# EAGLE schematic 005743-001 (EAGLE 6.6.0)

## Sheet 1 of 2
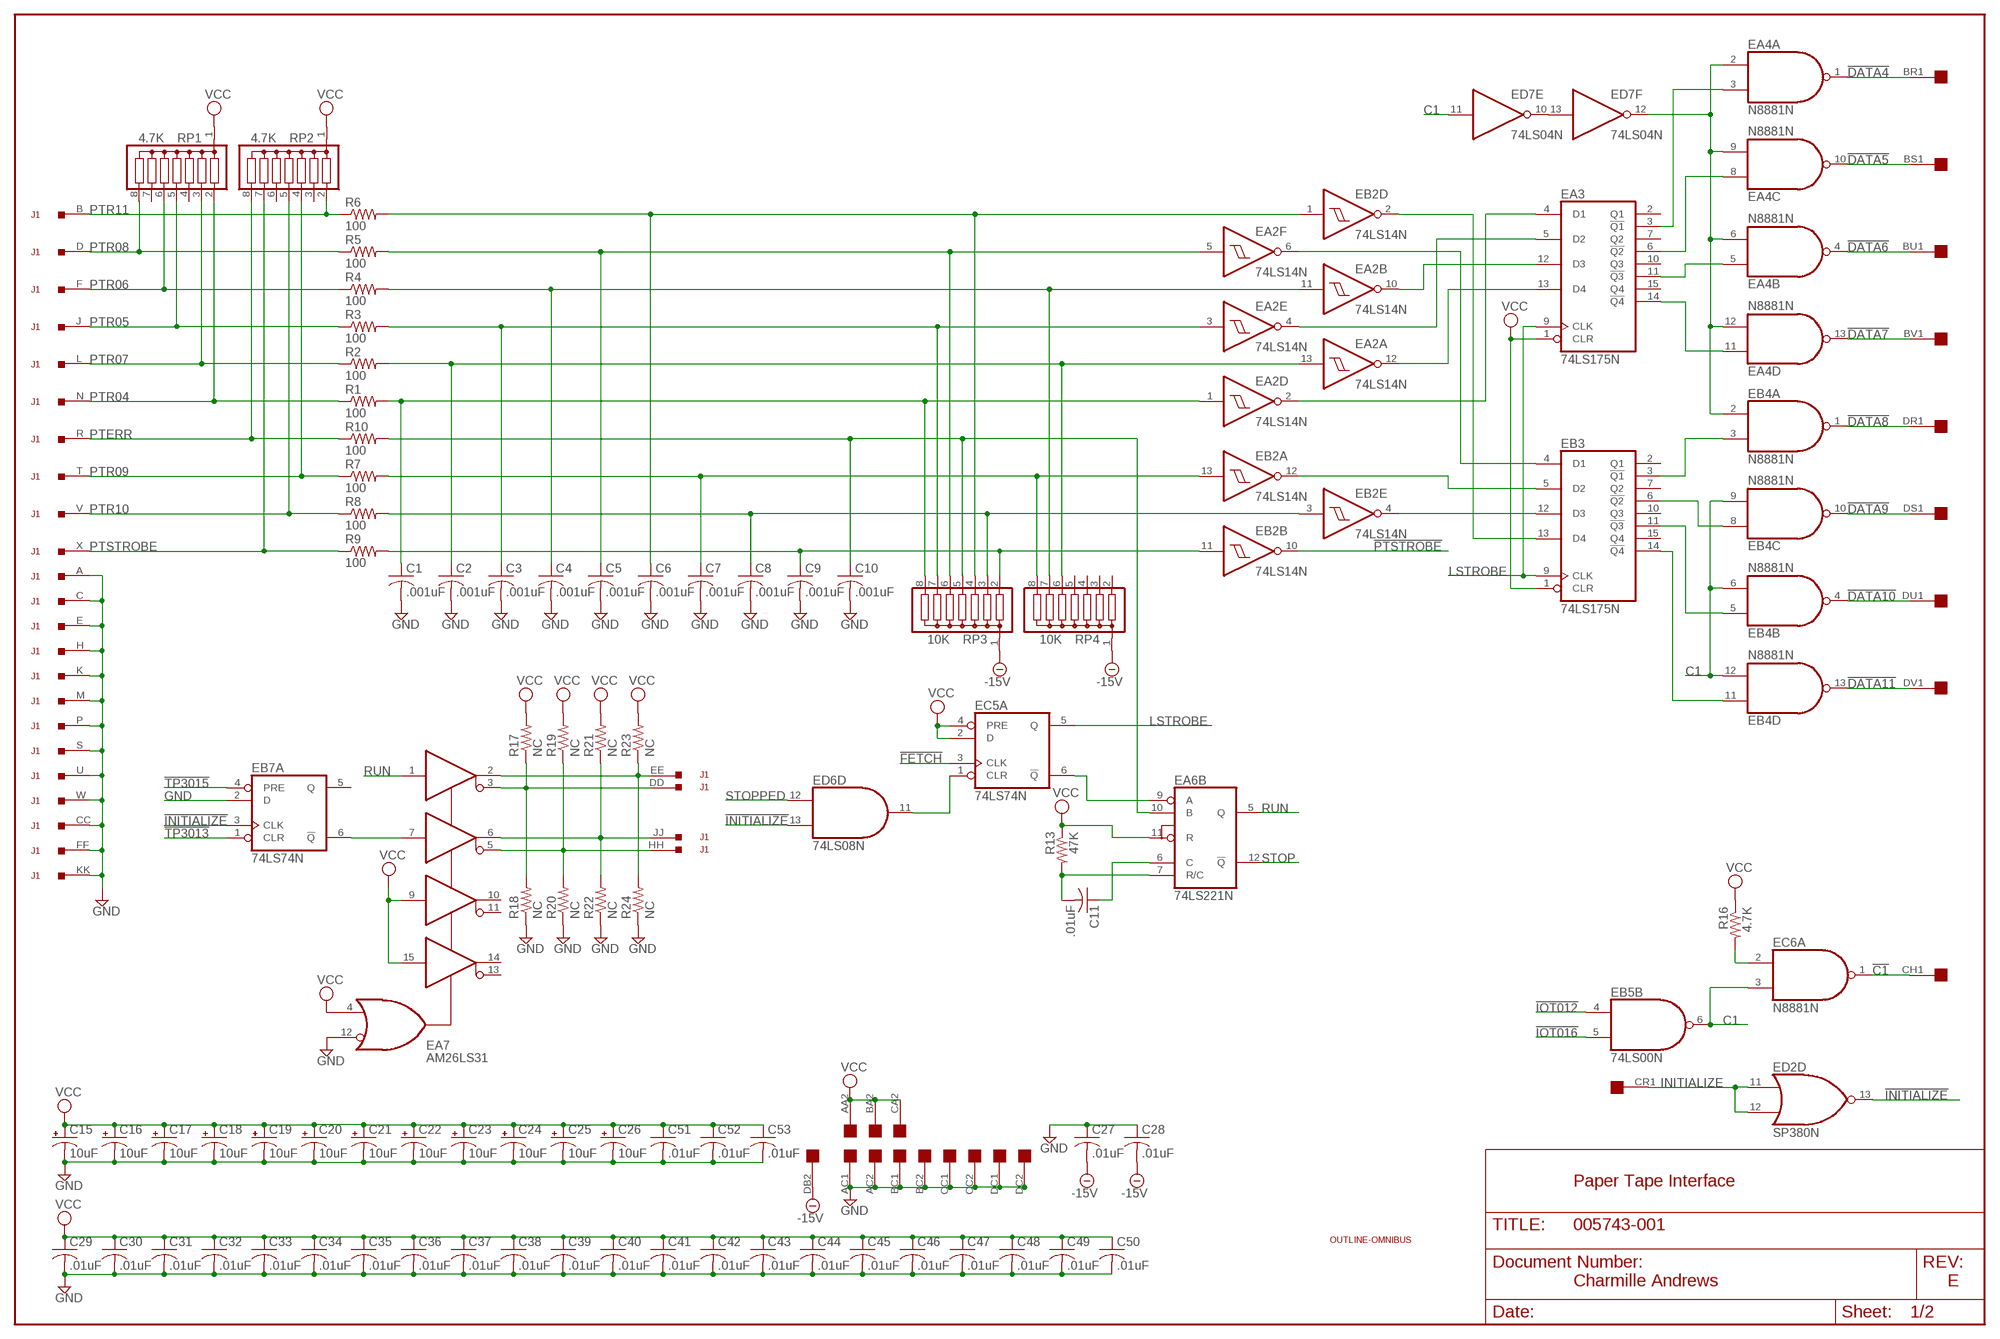
[diagram p0: schematic, sheet 1]

### Parts
C1  .001uF  C-US050-025X075  [C050-025X075]
C2  .001uF  C-US050-025X075  [C050-025X075]
C3  .001uF  C-US050-025X075  [C050-025X075]
C4  .001uF  C-US050-025X075  [C050-025X075]
C5  .001uF  C-US050-025X075  [C050-025X075]
C6  .001uF  C-US050-025X075  [C050-025X075]
C7  .001uF  C-US050-025X075  [C050-025X075]
C8  .001uF  C-US050-025X075  [C050-025X075]
C9  .001uF  C-US050-025X075  [C050-025X075]
C10  .001uF  C-US050-025X075  [C050-025X075]
C11  .01uF  C-US050-025X075  [C050-025X075]
C15  10uF  CPOL-USE15-5AXIAL  [E15-5]
C16  10uF  CPOL-USE15-5AXIAL  [E15-5]
C17  10uF  CPOL-USE15-5AXIAL  [E15-5]
C18  10uF  CPOL-USE15-5AXIAL  [E15-5]
C19  10uF  CPOL-USE15-5AXIAL  [E15-5]
C20  10uF  CPOL-USE15-5AXIAL  [E15-5]
C21  10uF  CPOL-USE15-5AXIAL  [E15-5]
C22  10uF  CPOL-USE15-5AXIAL  [E15-5]
C23  10uF  CPOL-USE15-5AXIAL  [E15-5]
C24  10uF  CPOL-USE15-5AXIAL  [E15-5]
C25  10uF  CPOL-USE15-5AXIAL  [E15-5]
C26  10uF  CPOL-USE15-5AXIAL  [E15-5]
C27  .01uF  C-US050-025X075  [C050-025X075]
C28  .01uF  C-US050-025X075  [C050-025X075]
C29  .01uF  C-US050-025X075  [C050-025X075]
C30  .01uF  C-US050-025X075  [C050-025X075]
C31  .01uF  C-US050-025X075  [C050-025X075]
C32  .01uF  C-US050-025X075  [C050-025X075]
C33  .01uF  C-US050-025X075  [C050-025X075]
C34  .01uF  C-US050-025X075  [C050-025X075]
C35  .01uF  C-US050-025X075  [C050-025X075]
C36  .01uF  C-US050-025X075  [C050-025X075]
C37  .01uF  C-US050-025X075  [C050-025X075]
C38  .01uF  C-US050-025X075  [C050-025X075]
C39  .01uF  C-US050-025X075  [C050-025X075]
C40  .01uF  C-US050-025X075  [C050-025X075]
C41  .01uF  C-US050-025X075  [C050-025X075]
C42  .01uF  C-US050-025X075  [C050-025X075]
C43  .01uF  C-US050-025X075  [C050-025X075]
C44  .01uF  C-US050-025X075  [C050-025X075]
C45  .01uF  C-US050-025X075  [C050-025X075]
C46  .01uF  C-US050-025X075  [C050-025X075]
C47  .01uF  C-US050-025X075  [C050-025X075]
C48  .01uF  C-US050-025X075  [C050-025X075]
C49  .01uF  C-US050-025X075  [C050-025X075]
C50  .01uF  C-US050-025X075  [C050-025X075]
C51  .01uF  C-US050-025X075  [C050-025X075]
C52  .01uF  C-US050-025X075  [C050-025X075]
C53  .01uF  C-US050-025X075  [C050-025X075]
EA2  74LS14N  [DIL14]
EA3  74LS175N  [DIL16]
EA4  N8881N  [DIL14]
EA6  74LS221N  [DIL16]
EA7  AM26LS31  [DIL16]
EB2  74LS14N  [DIL14]
EB3  74LS175N  [DIL16]
EB4  N8881N  [DIL14]
EB5  74LS00N  [DIL14]
EB7  74LS74N  [DIL14]
EC5  74LS74N  [DIL14]
EC6  N8881N  [DIL14]
ED2  SP380N  [DIL14]
ED6  74LS08N  [DIL14]
ED7  74LS04N  [DIL14]
J1  DEC40PINSH  [DEC40PINH]
R1  100  R-US_0207/12  [0207/12]
R2  100  R-US_0207/12  [0207/12]
R3  100  R-US_0207/12  [0207/12]
R4  100  R-US_0207/12  [0207/12]
R5  100  R-US_0207/12  [0207/12]
R6  100  R-US_0207/12  [0207/12]
R7  100  R-US_0207/12  [0207/12]
R8  100  R-US_0207/12  [0207/12]
R9  100  R-US_0207/12  [0207/12]
R10  100  R-US_0207/12  [0207/12]
R13  47K  R-US_0207/12  [0207/12]
R16  4.7K  R-US_0207/12  [0207/12]
R17  NC  R-US_0207/12  [0207/12]
R18  NC  R-US_0207/12  [0207/12]
R19  NC  R-US_0207/12  [0207/12]
R20  NC  R-US_0207/12  [0207/12]
R21  NC  R-US_0207/12  [0207/12]
R22  NC  R-US_0207/12  [0207/12]
R23  NC  R-US_0207/12  [0207/12]
R24  NC  R-US_0207/12  [0207/12]
RP1  4.7K  G07R  [SIL8]
RP2  4.7K  G07R  [SIL8]
RP3  10K  G07R  [SIL8]
RP4  10K  G07R  [SIL8]
U$1  OUTLINE-OMNIBUS  [OMNIBUS]
U$2  QUAD  [EDGE-CON8]

### Nets
!C1: EC6.1(A:O) U$2.CH1
!DATA4: EA4.1(A:O) U$2.BR1
!DATA5: EA4.10(C:O) U$2.BS1
!DATA6: EA4.4(B:O) U$2.BU1
!DATA7: EA4.13(D:O) U$2.BV1
!DATA8: EB4.1(A:O) U$2.DR1
!DATA9: EB4.10(C:O) U$2.DS1
!DATA10: EB4.4(B:O) U$2.DU1
!DATA11: EB4.13(D:O) U$2.DV1
!FETCH: EC5.3(A:CLK) ; also sheet 2
!INITIALIZE: EB7.3(A:CLK) ED2.13(D:O) ED6.13(D:I1) ; also sheet 2
!IOT012: EB5.4(B:I0) ; also sheet 2
!IOT016: EB5.5(B:I1) ; also sheet 2
!PTSTROBE: EB2.10(B:O) ; also sheet 2
!TP3013: EB7.1(A:CLR) ; also sheet 2
!TP3015: EB7.4(A:PRE) ; also sheet 2
-15V [supply]: C27.2 C28.2 RP3.1 RP4.1 U$2.DB2
C1: EB4.6(B:I1) EB4.9(C:I1) EB4.12(D:I1) EB5.6(B:O) EC6.3(A:I1) ED7.11(E:I)
GND [supply]: C1.2 C2.2 C3.2 C4.2 C5.2 C6.2 C7.2 C8.2 C9.2 C10.2 C15.- C16.- C17.- C18.- C19.- C20.- C21.- C22.- C23.- C24.- C25.- C26.- C27.1 C28.1 C29.2 C30.2 C31.2 C32.2 C33.2 C34.2 C35.2 C36.2 C37.2 C38.2 C39.2 C40.2 C41.2 C42.2 C43.2 C44.2 C45.2 C46.2 C47.2 C48.2 C49.2 C50.2 C51.2 C52.2 C53.2 EA7.12(!G) EB7.2(A:D) J1.A J1.C J1.CC J1.E J1.FF J1.H J1.K J1.KK J1.M J1.P J1.S J1.U J1.W R18.1 R20.1 R22.1 R24.1 U$2.AC1 U$2.AC2 U$2.BC1 U$2.BC2 U$2.CC1 U$2.CC2 U$2.DC1 U$2.DC2 ; also sheet 2
INITIALIZE: ED2.11(D:I0) ED2.12(D:I1) U$2.CR1
LSTROBE: EA3.9(CLK) EB3.9(CLK) EC5.5(A:Q) ; also sheet 2
N$18: EA4.2(A:I0) EA4.6(B:I1) EA4.9(C:I1) EA4.12(D:I1) EB4.2(A:I0) ED7.12(F:O)
N$19: EA2.6(F:O) EB3.4(D1)
N$20: ED7.10(E:O) ED7.13(F:I)
N$26: EA7.2(Y1) J1.EE R23.1 R24.2
N$33: EA7.3(Z1) J1.DD R17.1 R18.2
N$40: EC5.1(A:CLR) ED6.11(D:O)
N$41: EA7.5(Z2) J1.HH R19.1 R20.2
N$43: EA7.6(Y2) J1.JJ R21.1 R22.2
N$44: EB2.2(D:O) EB3.13(D4)
N$45: EA2.12(A:O) EA3.13(D4)
N$49: EA7.7(A2) EB7.6(A:!Q)
N$51: EA2.10(B:O) EA3.12(D3)
N$54: EA3.6(!Q2) EA4.8(C:I0)
N$65: EA6.9(B:A) EC5.6(A:!Q)
N$66: EC6.2(A:I0) R16.2
N$70: C10.1 EA6.10(B:B) R10.2 RP3.5
N$71: C11.1 EA6.6(B:C)
N$72: EA2.2(D:O) EA3.4(D1)
N$73: EA3.3(!Q1) EA4.3(A:I1)
N$76: EA3.14(!Q4) EA4.11(D:I0)
N$77: C11.2 EA6.7(B:R/C) R13.2
N$222: EB3.14(!Q4) EB4.11(D:I0)
N$224: EB3.6(!Q2) EB4.8(C:I0)
N$226: EB3.11(!Q3) EB4.5(B:I0)
N$227: EB3.3(!Q1) EB4.3(A:I1)
N$232: EB2.12(A:O) EB3.5(D2)
N$239: EB2.4(E:O) EB3.12(D3)
N$247: C7.1 EB2.13(A:I) R7.2 RP4.8
N$250: C8.1 EB2.3(E:I) R8.2 RP3.3
N$251: C6.1 EB2.1(D:I) R6.2 RP3.4
N$253: C9.1 EB2.11(B:I) R9.2 RP3.2
N$294: EA3.11(!Q3) EA4.5(B:I0)
N$300: EA2.4(E:O) EA3.5(D2)
N$313: C2.1 EA2.13(A:I) R2.2 RP4.6
N$315: C5.1 EA2.5(F:I) R5.2 RP3.6
N$316: C3.1 EA2.3(E:I) R3.2 RP3.7
N$317: C1.1 EA2.1(D:I) R1.2 RP3.8
N$319: C4.1 EA2.11(B:I) R4.2 RP4.7
PTERR: J1.R R10.1 RP2.8
PTR04: J1.N R1.1 RP1.2
PTR05: J1.J R3.1 RP1.5
PTR06: J1.F R4.1 RP1.6
PTR07: J1.L R2.1 RP1.3
PTR08: J1.D R5.1 RP1.8
PTR09: J1.T R7.1 RP2.4
PTR10: J1.V R8.1 RP2.5
PTR11: J1.B R6.1 RP2.2
PTSTROBE: J1.X R9.1 RP2.7
RUN: EA6.5(B:Q) EA7.1(A1) ; also sheet 2
STOP: EA6.12(B:!Q) ; also sheet 2
STOPPED: ED6.12(D:I0) ; also sheet 2
VCC [supply]: C15.+ C16.+ C17.+ C18.+ C19.+ C20.+ C21.+ C22.+ C23.+ C24.+ C25.+ C26.+ C29.1 C30.1 C31.1 C32.1 C33.1 C34.1 C35.1 C36.1 C37.1 C38.1 C39.1 C40.1 C41.1 C42.1 C43.1 C44.1 C45.1 C46.1 C47.1 C48.1 C49.1 C50.1 C51.1 C52.1 C53.1 EA3.1(CLR) EA6.11(B:R) EA7.4(G) EA7.9(A3) EA7.15(A4) EB3.1(CLR) EC5.2(A:D) EC5.4(A:PRE) R13.1 R16.1 R17.2 R19.2 R21.2 R23.2 RP1.1 RP2.1 U$2.AA2 U$2.BA2 U$2.CA2 ; also sheet 2
Unconnected: EA3.2(Q1) EA3.7(Q2) EA3.10(Q3) EA3.15(Q4) EA7.10(Y3) EA7.11(Z3) EA7.13(Z4) EA7.14(Y4) EB3.2(Q1) EB3.7(Q2) EB3.10(Q3) EB3.15(Q4) EB7.5(A:Q) ED7.8(D:O) ED7.9(D:I) J1.AA J1.BB J1.LL J1.MM J1.NN J1.PP J1.RR J1.SS J1.TT J1.UU J1.VV J1.Y J1.Z RP1.4 RP1.7 RP2.3 RP2.6 RP4.2 RP4.3 RP4.4 RP4.5 U$2.AA1 U$2.AB1 U$2.AB2 U$2.AD1 U$2.AD2 U$2.AE1 U$2.AE2 U$2.AF1 U$2.AF2 U$2.AH1 U$2.AH2 U$2.AJ1 U$2.AJ2 U$2.AK1 U$2.AK2 U$2.AL1 U$2.AL2 U$2.AM1 U$2.AM2 U$2.AN1 U$2.AN2 U$2.AP2 U$2.AR1 U$2.AR2 U$2.AS1 U$2.AS2 U$2.AT1 U$2.AT2 U$2.AU1 U$2.AU2 U$2.AV1 U$2.AV2 U$2.BA1 U$2.BB1 U$2.BB2 U$2.BD1 U$2.BD2 U$2.BE1 U$2.BE2 U$2.BF1 U$2.BF2 U$2.BH1 U$2.BH2 U$2.BJ1 U$2.BJ2 U$2.BK2 U$2.BL2 U$2.BM2 U$2.BN1 U$2.BN2 U$2.BP2 U$2.BR2 U$2.BS2 U$2.BT1 U$2.BT2 U$2.BU2 U$2.BV2 U$2.CA1 U$2.CB1 U$2.CB2 U$2.CD2 U$2.CE1 U$2.CE2 U$2.CF1 U$2.CF2 U$2.CJ1 U$2.CJ2 U$2.CK1 U$2.CK2 U$2.CL2 U$2.CM1 U$2.CM2 U$2.CN1 U$2.CN2 U$2.CP2 U$2.CR2 U$2.CS2 U$2.CT1 U$2.CT2 U$2.CU1 U$2.CU2 U$2.CV1 U$2.CV2 U$2.DA1 U$2.DA2 U$2.DB1 U$2.DD1 U$2.DD2 U$2.DE1 U$2.DE2 U$2.DF1 U$2.DF2 U$2.DH1 U$2.DH2 U$2.DJ1 U$2.DJ2 U$2.DK2 U$2.DL2 U$2.DM2 U$2.DN1 U$2.DN2 U$2.DP2 U$2.DR2 U$2.DS2 U$2.DT1 U$2.DT2 U$2.DU2 U$2.DV2

### Notes on the sheet
- Paper Tape Interface
- Charmille Andrews | E

## Sheet 2 of 2
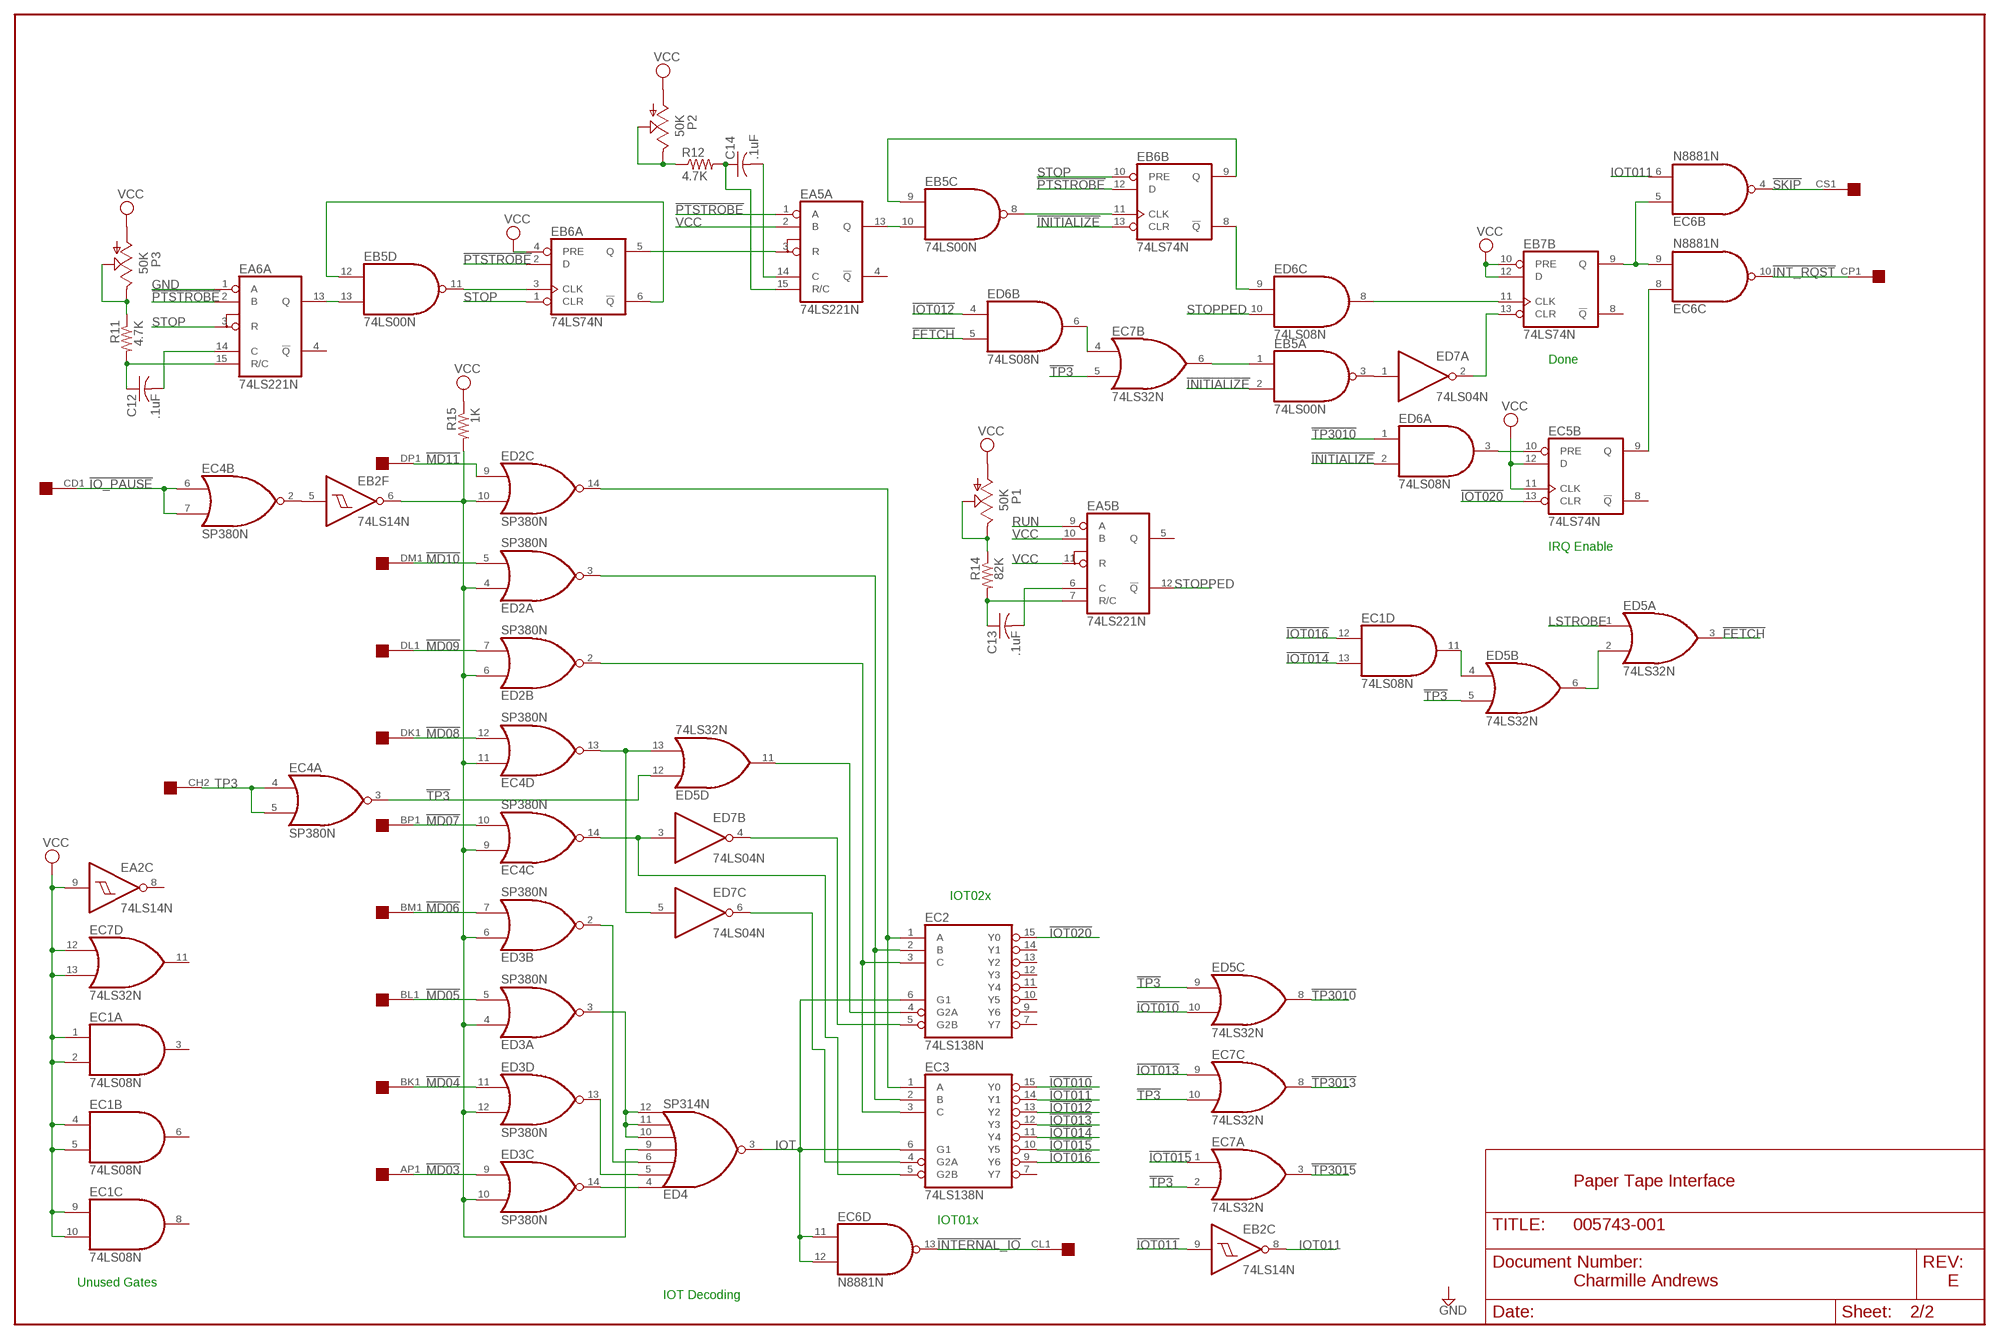
[diagram p1: schematic, sheet 2]

### Parts
C12  .1uF  C-US150-054X183  [C150-054X183]
C13  .1uF  C-US150-054X183  [C150-054X183]
C14  .1uF  C-US150-054X183  [C150-054X183]
EA5  74LS221N  [DIL16]
EB6  74LS74N  [DIL14]
EC1  74LS08N  [DIL14]
EC2  74LS138N  [DIL16]
EC3  74LS138N  [DIL16]
EC4  SP380N  [DIL14]
EC7  74LS32N  [DIL14]
ED3  SP380N  [DIL14]
ED4  SP314N  [DIL14]
ED5  74LS32N  [DIL14]
P1  50K  TRIM_US-S43P  [SP19L]
P2  50K  TRIM_US-S43P  [SP19L]
P3  50K  TRIM_US-S43P  [SP19L]
R11  4.7K  R-US_0207/12  [0207/12]
R12  4.7K  R-US_0207/12  [0207/12]
R14  82K  R-US_0207/12  [0207/12]
R15  1K  R-US_0207/12  [0207/12]

### Nets
!FETCH: ED5.3(A:O) ED6.5(B:I1) ; also sheet 1
!INITIALIZE: EB5.2(A:I1) EB6.13(B:CLR) ED6.2(A:I1) ; also sheet 1
!INT_RQST: EC6.10(C:O) U$2.CP1
!INTERNAL_IO: EC6.13(D:O) U$2.CL1
!IO_PAUSE: EC4.6(B:I0) EC4.7(B:I1) U$2.CD1
!IOT010: EC3.15(Y0) ED5.10(C:I1)
!IOT011: EB2.9(C:I) EC3.14(Y1)
!IOT012: EC3.13(Y2) ED6.4(B:I0) ; also sheet 1
!IOT013: EC3.12(Y3) EC7.9(C:I0)
!IOT014: EC1.13(D:I1) EC3.11(Y4)
!IOT015: EC3.10(Y5) EC7.1(A:I0)
!IOT016: EC1.12(D:I0) EC3.9(Y6) ; also sheet 1
!IOT020: EC2.15(Y0) EC5.13(B:CLR)
!MD03: ED3.9(C:I0) U$2.AP1
!MD04: ED3.11(D:I0) U$2.BK1
!MD05: ED3.5(A:I1) U$2.BL1
!MD06: ED3.7(B:I1) U$2.BM1
!MD07: EC4.10(C:I1) U$2.BP1
!MD08: EC4.12(D:I1) U$2.DK1
!MD09: ED2.7(B:I1) U$2.DL1
!MD10: ED2.5(A:I1) U$2.DM1
!MD11: ED2.9(C:I0) U$2.DP1
!PTSTROBE: EA5.1(A:A) EA6.2(A:B) EB6.2(A:D) EB6.12(B:D) ; also sheet 1
!SKIP: EC6.4(B:O) U$2.CS1
!TP3: EC4.3(A:O) EC7.2(A:I1) EC7.5(B:I1) EC7.10(C:I1) ED5.5(B:I1) ED5.9(C:I0) ED5.12(D:I0)
!TP3010: ED5.8(C:O) ED6.1(A:I0)
!TP3013: EC7.8(C:O) ; also sheet 1
!TP3015: EC7.3(A:O) ; also sheet 1
GND [supply]: EA6.1(A:A) ; also sheet 1
IOT: EC2.6(G1) EC3.6(G1) EC6.11(D:I0) EC6.12(D:I1) ED4.3(O)
IOT011: EB2.8(C:O) EC6.6(B:I1)
LSTROBE: ED5.1(A:I0) ; also sheet 1
N$1: EB5.3(A:O) ED7.1(A:I)
N$22: EC4.13(D:O) ED5.13(D:I1) ED7.5(C:I)
N$23: EC3.5(G2B) EC4.14(C:O) ED7.3(B:I)
N$24: EB7.13(B:CLR) ED7.2(A:O)
N$25: EC3.4(G2A) ED7.6(C:O)
N$29: EB7.11(B:CLK) ED6.8(C:O)
N$34: EB6.8(B:!Q) ED6.9(C:I0)
N$38: EC5.10(B:PRE) ED6.3(A:O)
N$39: EC7.4(B:I0) ED6.6(B:O)
N$48: C12.2 EA6.14(A:C)
N$52: C14.1 EA5.15(A:R/C) R12.2
N$53: EA5.3(A:R) EB6.5(A:Q)
N$57: EC1.11(D:O) ED5.4(B:I0)
N$58: ED5.2(A:I1) ED5.6(B:O)
N$59: EA6.13(A:Q) EB5.13(D:I1)
N$61: EC2.4(G2A) ED5.11(D:O)
N$62: ED3.14(C:O) ED4.4(I0)
N$64: ED3.3(A:O) ED4.10(I4) ED4.11(I5) ED4.12(I6)
N$67: EB2.6(F:O) EC4.9(C:I0) EC4.11(D:I0) ED2.4(A:I0) ED2.6(B:I0) ED2.10(C:I1) ED3.4(A:I0) ED3.6(B:I0) ED3.10(C:I1) ED3.12(D:I1) ED4.9(I3) R15.2
N$68: ED3.2(B:O) ED4.6(I2)
N$69: ED3.13(D:O) ED4.5(I1)
N$75: EB2.5(F:I) EC4.2(B:O)
N$82: EC2.1(A) EC3.1(A) ED2.14(C:O)
N$87: EC2.5(G2B) ED7.4(B:O)
N$91: EC2.2(B) EC3.2(B) ED2.3(A:O)
N$92: EC2.3(C) EC3.3(C) ED2.2(B:O)
N$106: EB7.9(B:Q) EC6.5(B:I0) EC6.9(C:I1)
N$107: EC5.9(B:Q) EC6.8(C:I0)
N$130: EB5.1(A:I0) EC7.6(B:O)
N$182: EB5.8(C:O) EB6.11(B:CLK)
N$188: EB5.9(C:I0) EB6.9(B:Q)
N$198: EB5.11(D:O) EB6.3(A:CLK)
N$204: EB5.12(D:I0) EB6.6(A:!Q)
N$211: EA5.13(A:Q) EB5.10(C:I1)
N$268: C12.1 EA6.15(A:R/C) R11.2
N$276: C13.2 EA5.6(B:C)
N$277: C13.1 EA5.7(B:R/C) R14.2
N$283: C14.2 EA5.14(A:C)
N$328: P1.E P1.S R14.1
N$330: P2.E P2.S R12.1
N$334: P3.E P3.S R11.1
RUN: EA5.9(B:A) ; also sheet 1
STOP: EA6.3(A:R) EB6.1(A:CLR) EB6.10(B:PRE) ; also sheet 1
STOPPED: EA5.12(B:!Q) ED6.10(C:I1) ; also sheet 1
TP3: EC4.4(A:I0) EC4.5(A:I1) U$2.CH2
VCC [supply]: EA2.9(C:I) EA5.2(A:B) EA5.10(B:B) EA5.11(B:R) EB6.4(A:PRE) EB7.10(B:PRE) EB7.12(B:D) EC1.1(A:I0) EC1.2(A:I1) EC1.4(B:I0) EC1.5(B:I1) EC1.9(C:I0) EC1.10(C:I1) EC5.11(B:CLK) EC5.12(B:D) EC7.12(D:I0) EC7.13(D:I1) P1.A P2.A P3.A R15.1 ; also sheet 1
Unconnected: EA2.8(C:O) EA5.4(A:!Q) EA5.5(B:Q) EA6.4(A:!Q) EB7.8(B:!Q) EC1.3(A:O) EC1.6(B:O) EC1.8(C:O) EC2.7(Y7) EC2.9(Y6) EC2.10(Y5) EC2.11(Y4) EC2.12(Y3) EC2.13(Y2) EC2.14(Y1) EC3.7(Y7) EC5.8(B:!Q) EC7.11(D:O)

### Notes on the sheet
- Done
- IRQ Enable
- IOT02x
- Paper Tape Interface
- IOT01x
- Unused Gates | Charmille Andrews | E
- IOT Decoding

## Power pins joined to a net without a drawn wire
GND: EA2.7(P:GND) EA3.8(GND) EA4.7(P:GND) EA5.8(P:GND) EA6.8(P:GND) EA7.8(GND) EB2.7(P:GND) EB3.8(GND) EB4.7(P:GND) EB5.7(P:GND) EB6.7(P:GND) EB7.7(P:GND) EC1.7(P:GND) EC2.8(GND) EC3.8(GND) EC4.1(P:GND) EC5.7(P:GND) EC6.7(P:GND) EC7.7(P:GND) ED2.1(P:GND) ED3.1(P:GND) ED4.1(GND) ED5.7(P:GND) ED6.7(P:GND) ED7.7(P:GND)
VCC: EA2.14(P:VCC) EA3.16(VCC) EA4.14(P:VCC) EA5.16(P:VCC) EA6.16(P:VCC) EA7.16(VCC) EB2.14(P:VCC) EB3.16(VCC) EB4.14(P:VCC) EB5.14(P:VCC) EB6.14(P:VCC) EB7.14(P:VCC) EC1.14(P:VCC) EC2.16(VCC) EC3.16(VCC) EC4.8(P:VCC) EC5.14(P:VCC) EC6.14(P:VCC) EC7.14(P:VCC) ED2.8(P:VCC) ED3.8(P:VCC) ED4.8(VCC) ED5.14(P:VCC) ED6.14(P:VCC) ED7.14(P:VCC)

## Library data of the parts
C1-C14 C27-C53 = rcl:C-US: CAPACITOR, American symbol
C15 C18 C20-C22 = dec-con:CPOL-USE15-5AXIAL: 0.5" veresion of an electrolytic
C16 C17 C19 C23-C26 = rcl:CPOL-US: POLARIZED CAPACITOR, American symbol
EA2 EB2 = 74xx-us:74*14: Hex schmitt trigger INVERTER
EA3 EB3 = 74xx-us:74*175: Qadruple D type FLIP FLOP, clear
EA4 EB4 EC6 = dec-con:N8881: Quad 2-input NAND gate, open collector
EA5 EA6 = 74xx-eu:74*221: Dual Monostable MULTIVIBRATOR, schmitt trigger inputs
EA7 = dec-con:AM26LS31: Quad RS-422 Driver
EB5 = 74xx-us:74*00: Quad 2-input NAND gate
EB6 EB7 EC5 = 74xx-us:74*74: Dual D type positive edge triggered FLIP FLOP, preset and clear
EC1 ED6 = 74xx-us:74*08: Quad 2-input AND gate
EC2 EC3 = 74xx-us:74*138: 3-line to 8-line DECODER/DEMULTIPLEXER
EC4 ED2 ED3 = dec-con:SP380: Quad NOR gate (use 8640)
EC7 ED5 = 74xx-us:74*32: Quad 2-input OR gate
ED4 = dec-con:SP314: 7-Input NOR gate
ED7 = 74xx-us:74*04: Hex INVERTER
J1 = dec-con:DEC40PINS: 40 pin ribbon connector for BC08, BC11 cables.
P1-P3 = pot:TRIM_US-: POTENTIOMETER
R1-R24 = rcl:R-US_: RESISTOR, American symbol
RP1-RP4 = resistor-sil:G07R: SIL RESISTOR; OC_FARNELL: unknown; OC_NEWARK: unknown
U$1 = dec-con:OUTLINE-*: Board outlines for DEC boards.
U$2 = dec-con:QUAD: Quad-Height DEC board

## Net classes
1 supply: width 0.813 mm